# Altium schematic sheet USB-C_connector.SchDoc
size A4; Date: 08.06.2024; ApprovedBy: Jan Macheta; Author: Mikołaj Pichita; SheetNumber: 7; SheetTotal: 8
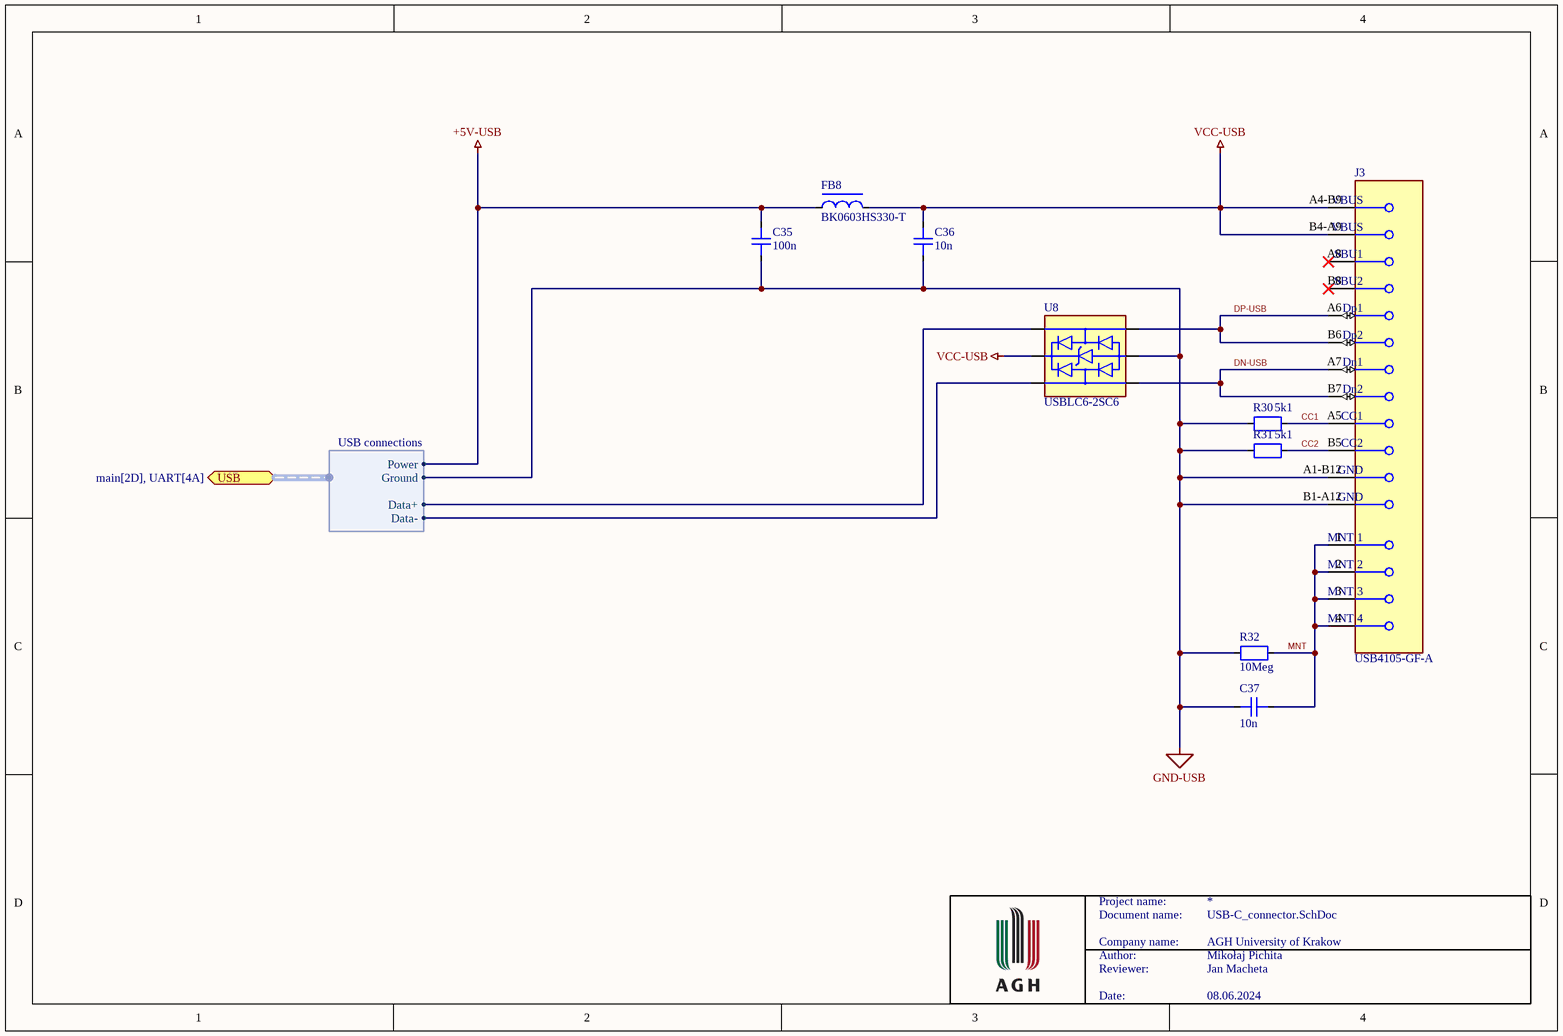
[diagram p0: USB-C_connector.SchDoc]

## Parts
C35  100n  [CAP0603]
C36  10n  [CAP0603]
C37  10n  [CAP0603]
FB8  BK0603HS330-T  [FB0402]
J3  USB4105-GF-A  [FP-USB4105-GF-A-MFG]
R30  5k1  [RES0603]
R31  5k1  [RES0603]
R32  10Meg  [RES0603]
U8  USBLC6-2SC6  [SOT95P280X145-6N]

## Ports
USB (bidir, harness USB connections, see main[2D], UART[4A])

## Harnesses
USB connections: Power, Data+, Data-, Ground

## Nets
+5V-USB: C35.1 FB8.1 ; port USB.Power
GND-USB: C35.2 C36.2 C37.2 J3.A1-B12(GND) J3.B1-A12(GND) R30.1 R31.1 R32.1 U8.2(GND) ; port USB.Ground
VCC-USB: C36.1 FB8.2 J3.A4-B9(VBUS) J3.B4-A9(VBUS) U8.5(VBUS)
CC1: J3.A5(CC1) R30.2
CC2: J3.B5(CC2) R31.2
DN-USB: J3.A7(Dn1) J3.B7(Dn2) U8.1(I/O1)
DP-USB: J3.A6(Dp1) J3.B6(Dp2) U8.3(I/O2)
MNT: C37.1 J3.1(MNT_1) J3.2(MNT_2) J3.3(MNT_3) J3.4(MNT_4) R32.2
NetU8_4: U8.4(I/O2) ; port USB.Data+
NetU8_6: U8.6(I/O1) ; port USB.Data-

Not connected (* = marked no-connect by the designer): J3 A8(SBU1)* B8(SBU2)*

## Notes on the sheet
- Project name:
- Document name:
- Company name:
- Author:
- Reviewer:
- AGH University of Krakow
- Date:

## Library data of the parts
C35-C37 = Capacitor: Value: *; HelpURL: *; MPN: *; Supplier: *; SupplierPartNumber: *
FB8 = Ferrite Bead: Value: *; HelpURL: *; MPN: *; Supplier: *; SupplierPartNumber: *
J3 = USB4105-GF-A: CONN RCPT USB2.0 TYPEC 5A; Manufacturer: GCT; Voltage Rating: 20V; Is Female: yes; Current Rating: 5/6.25/1.25/0.25A; Number Of Contacts: 16; Conn Orientation: Right Angle; Device Class L1: Connectors; Category: Conn; Lead Free: Yes; RoHS: TRUE; Temperature Range High: +85°C; Digikey Description: CONN RCPT USB2.0 TYPEC 5A; Device Class L3: unset; ComponentLink2Description: Datasheet; Manufacturer Part Number: USB4105-GF-A; Package: 0; Usb Standard: USB 2.0; Device Class L2: USB Connectors; Automotive: No; Temperature Range Low: -40°C; Height: 3.46mm; Temperature: -40°C to +85°C; Contact Material: Gold,Nickel; ComponentLink2URL: https://gct.co/files/drawings/usb4105.pdf; Octopart: https://octopart.com/usb4105-gf-a-gct-106627878
R30-R32 = Resistor: Value: *; HelpURL: *; MPN: *; Supplier: *; SupplierPartNumber: *
U8 = USBLC6-2SC6: Very low capacitance ESD protection; Value: *; HelpURL: *; MPN: *; Supplier: *; SupplierPartNumber: *